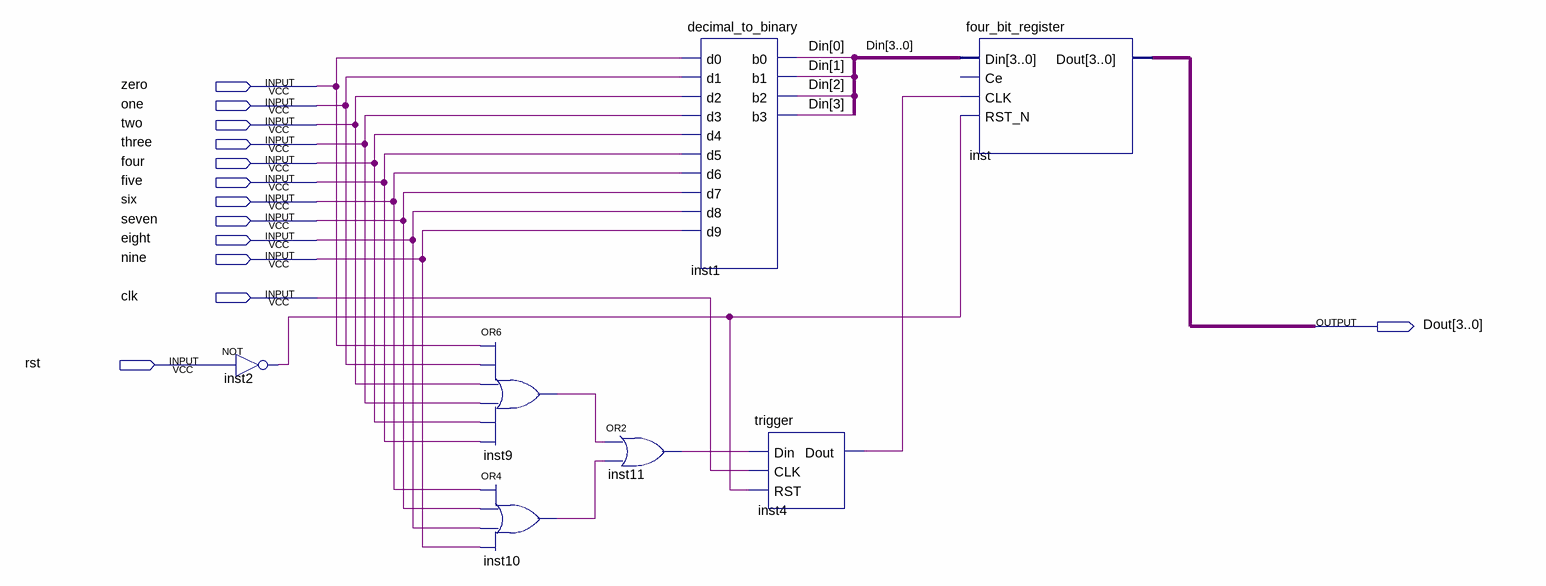
[diagram p0: schematic sheet]
// Quartus schematic work1.bdf as structural Verilog: 7 symbols, 13 pins
module work1 (
  input  zero,
  input  one,
  input  two,
  input  three,
  input  four,
  input  five,
  input  six,
  input  seven,
  input  eight,
  input  nine,
  input  clk,
  input  rst,
  output [3:0] Dout
);

  wire inst2_out, inst4_dout, inst9_out, inst10_out, inst11_out;
  wire [3:0] Din;

  not inst2 (inst2_out, rst);
  or inst9 (inst9_out, zero, one, two, three, four, five);
  or inst10 (inst10_out, six, seven, eight, nine);
  or inst11 (inst11_out, inst9_out, inst10_out);
  decimal_to_binary inst1 (
    .d0(zero), .d1(one), .d2(two), .d3(three), .d4(four), .d5(five), .d6(six), .d7(seven), .d8(eight),
    .d9(nine), .b0(Din[0]), .b1(Din[1]), .b2(Din[2]), .b3(Din[3]));
  trigger inst4 (.Din(inst11_out), .CLK(clk), .RST(inst2_out), .Dout(inst4_dout));
  four_bit_register inst (.Din(Din), .CLK(inst4_dout), .RST_N(inst2_out), .Dout(Dout));  // open: Ce
endmodule
